# EAGLE design untitled (EAGLE 9.4.2)
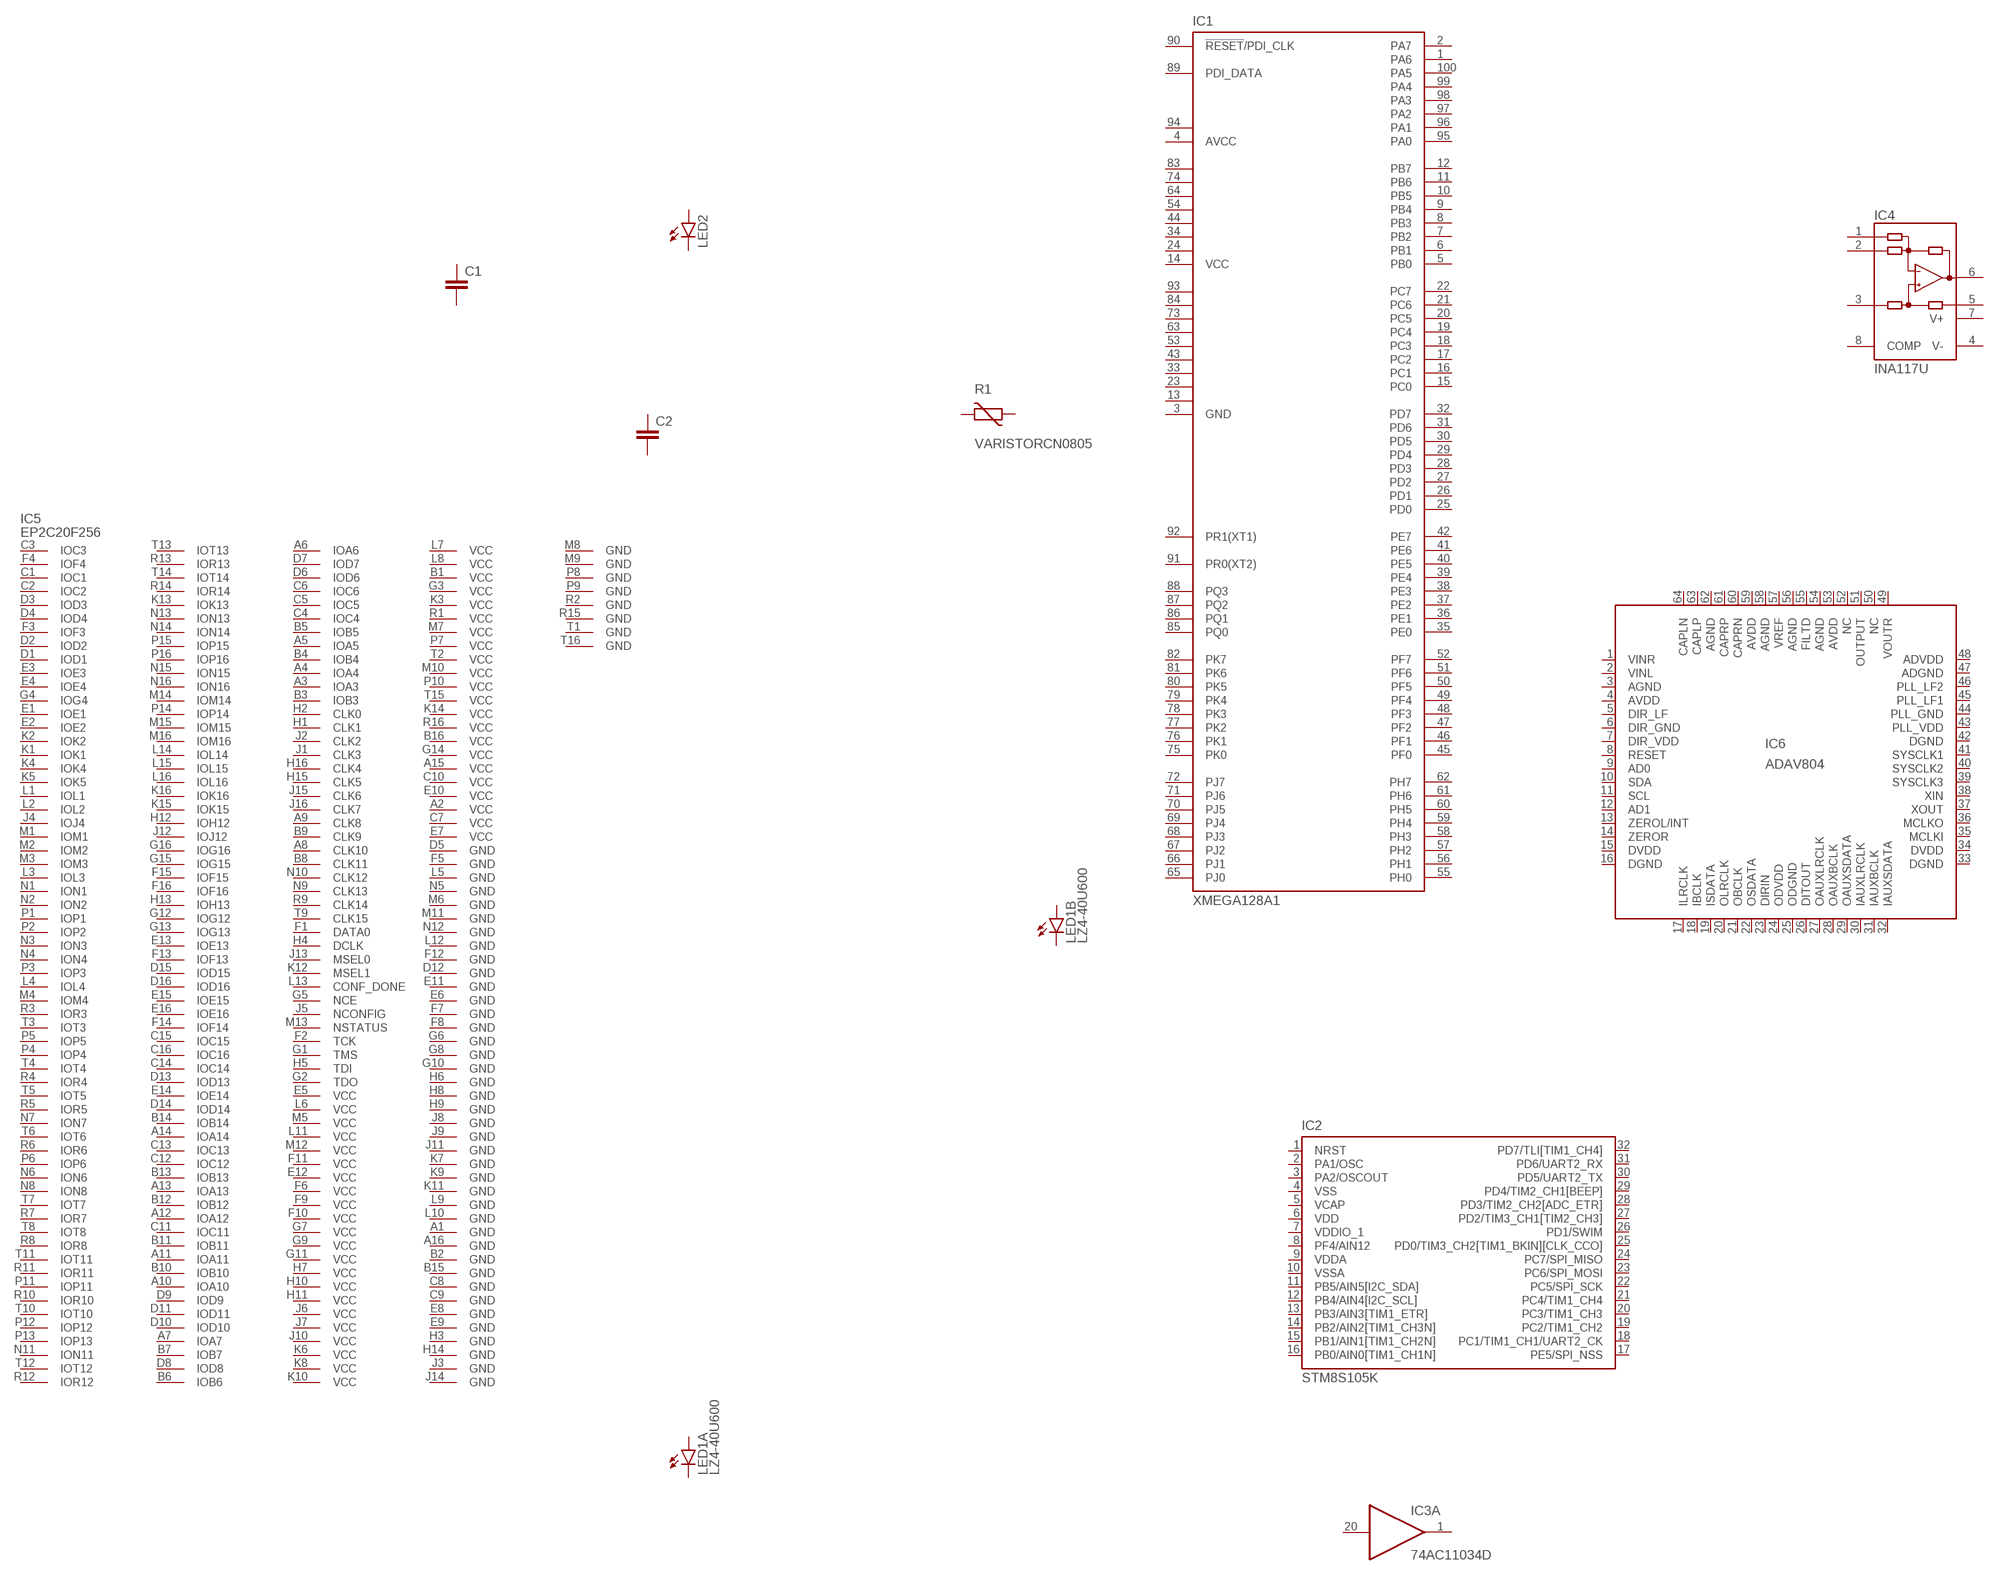
[diagram p0: schematic, sheet 1]

## Parts
C1  C-EUC1206  [C1206]
C2  C-EUC1206  [C1206]
IC1  XMEGA128A1  [TQFP100]
IC2  STM8S105K  [UFQFPN32]
IC3  74AC11034D  [SO20W]
IC4  INA117U  [SO08]
IC5  EP2C20F256  [FBGA256]
IC6  ADAV804  [LQFP-ST-64-2]
LED1  LZ4-40U600  [LZ4-40U600]
LED2  LEDSMT1206  [1206]
R1  VARISTORCN0805  [CT/CN0805]
Unconnected: C1.1 C1.2 C2.1 C2.2 IC1.1(PA6) IC1.2(PA7) IC1.5(PB0) IC1.6(PB1) IC1.7(PB2) IC1.8(PB3) IC1.9(PB4) IC1.10(PB5) IC1.11(PB6) IC1.12(PB7) IC1.15(PC0) IC1.16(PC1) IC1.17(PC2) IC1.18(PC3) IC1.19(PC4) IC1.20(PC5) IC1.21(PC6) IC1.22(PC7) IC1.25(PD0) IC1.26(PD1) IC1.27(PD2) IC1.28(PD3) IC1.29(PD4) IC1.30(PD5) IC1.31(PD6) IC1.32(PD7) IC1.35(PE0) IC1.36(PE1) IC1.37(PE2) IC1.38(PE3) IC1.39(PE4) IC1.40(PE5) IC1.41(PE6) IC1.42(PE7) IC1.45(PF0) IC1.46(PF1) IC1.47(PF2) IC1.48(PF3) IC1.49(PF4) IC1.50(PF5) IC1.51(PF6) IC1.52(PF7) IC1.55(PH0) IC1.56(PH1) IC1.57(PH2) IC1.58(PH3) IC1.59(PH4) IC1.60(PH5) IC1.61(PH6) IC1.62(PH7) IC1.65(PJ0) IC1.66(PJ1) IC1.67(PJ2) IC1.68(PJ3) IC1.69(PJ4) IC1.70(PJ5) IC1.71(PJ6) IC1.72(PJ7) IC1.75(PK0) IC1.76(PK1) IC1.77(PK2) IC1.78(PK3) IC1.79(PK4) IC1.80(PK5) IC1.81(PK6) IC1.82(PK7) IC1.85(PQ0) IC1.86(PQ1) IC1.87(PQ2) IC1.88(PQ3) IC1.89(PDI_DATA) IC1.90(!RESET!/PDI_CLK) IC1.91(PR0(XT2)) IC1.92(PR1(XT1)) IC1.95(PA0) IC1.96(PA1) IC1.97(PA2) IC1.98(PA3) IC1.99(PA4) IC1.100(PA5) IC2.1(NRST) IC2.2(PA1/OSC) IC2.3(PA2/OSCOUT) IC2.8(PF4/AIN12) IC2.11(PB5/AIN5[I2C_SDA]) IC2.12(PB4/AIN4[I2C_SCL]) IC2.13(PB3/AIN3[TIM1_ETR]) IC2.14(PB2/AIN2[TIM1_CH3N]) IC2.15(PB1/AIN1[TIM1_CH2N]) IC2.16(PB0/AIN0[TIM1_CH1N]) IC2.17(PE5/SPI_NSS) IC2.18(PC1/TIM1_CH1/UART2_CK) IC2.19(PC2/TIM1_CH2) IC2.20(PC3/TIM1_CH3) IC2.21(PC4/TIM1_CH4) IC2.22(PC5/SPI_SCK) IC2.23(PC6/SPI_MOSI) IC2.24(PC7/SPI_MISO) IC2.25(PD0/TIM3_CH2[TIM1_BKIN][CLK_CCO]) IC2.26(PD1/SWIM) IC2.27(PD2/TIM3_CH1[TIM2_CH3]) IC2.28(PD3/TIM2_CH2[ADC_ETR]) IC2.29(PD4/TIM2_CH1[BEEP]) IC2.30(PD5/UART2_TX) IC2.31(PD6/UART2_RX) IC2.32(PD7/TLI[TIM1_CH4]) IC3.1(A:O) IC3.2(B:O) IC3.3(C:O) IC3.8(D:O) IC3.9(E:O) IC3.10(F:O) IC3.11(F:I) IC3.12(E:I) IC3.13(D:I) IC3.18(C:I) IC3.19(B:I) IC3.20(A:I) IC4.1(REFB) IC4.2(-IN) IC4.3(+IN) IC4.5(REFA) IC4.6(OUT) IC4.8(COMP) IC5.A3(IOA3) IC5.A4(IOA4) IC5.A5(IOA5) IC5.A6(IOA6) IC5.A7(IOA7) IC5.A8(CLK10) IC5.A9(CLK8) IC5.A10(IOA10) IC5.A11(IOA11) IC5.A12(IOA12) IC5.A13(IOA13) IC5.A14(IOA14) IC5.B3(IOB3) IC5.B4(IOB4) IC5.B5(IOB5) IC5.B6(IOB6) IC5.B7(IOB7) IC5.B8(CLK11) IC5.B9(CLK9) IC5.B10(IOB10) IC5.B11(IOB11) IC5.B12(IOB12) IC5.B13(IOB13) IC5.B14(IOB14) IC5.C1(IOC1) IC5.C2(IOC2) IC5.C3(IOC3) IC5.C4(IOC4) IC5.C5(IOC5) IC5.C6(IOC6) IC5.C11(IOC11) IC5.C12(IOC12) IC5.C13(IOC13) IC5.C14(IOC14) IC5.C15(IOC15) IC5.C16(IOC16) IC5.D1(IOD1) IC5.D2(IOD2) IC5.D3(IOD3) IC5.D4(IOD4) IC5.D6(IOD6) IC5.D7(IOD7) IC5.D8(IOD8) IC5.D9(IOD9) IC5.D10(IOD10) IC5.D11(IOD11) IC5.D13(IOD13) IC5.D14(IOD14) IC5.D15(IOD15) IC5.D16(IOD16) IC5.E1(IOE1) IC5.E2(IOE2) IC5.E3(IOE3) IC5.E4(IOE4) IC5.E13(IOE13) IC5.E14(IOE14) IC5.E15(IOE15) IC5.E16(IOE16) IC5.F1(DATA0) IC5.F2(TCK) IC5.F3(IOF3) IC5.F4(IOF4) IC5.F13(IOF13) IC5.F14(IOF14) IC5.F15(IOF15) IC5.F16(IOF16) IC5.G1(TMS) IC5.G2(TDO) IC5.G4(IOG4) IC5.G5(NCE) IC5.G12(IOG12) IC5.G13(IOG13) IC5.G15(IOG15) IC5.G16(IOG16) IC5.H1(CLK1) IC5.H2(CLK0) IC5.H4(DCLK) IC5.H5(TDI) IC5.H12(IOH12) IC5.H13(IOH13) IC5.H15(CLK5) IC5.H16(CLK4) IC5.J1(CLK3) IC5.J2(CLK2) IC5.J4(IOJ4) IC5.J5(NCONFIG) IC5.J12(IOJ12) IC5.J13(MSEL0) IC5.J15(CLK6) IC5.J16(CLK7) IC5.K1(IOK1) IC5.K2(IOK2) IC5.K4(IOK4) IC5.K5(IOK5) IC5.K12(MSEL1) IC5.K13(IOK13) IC5.K15(IOK15) IC5.K16(IOK16) IC5.L1(IOL1) IC5.L2(IOL2) IC5.L3(IOL3) IC5.L4(IOL4) IC5.L13(CONF_DONE) IC5.L14(IOL14) IC5.L15(IOL15) IC5.L16(IOL16) IC5.M1(IOM1) IC5.M2(IOM2) IC5.M3(IOM3) IC5.M4(IOM4) IC5.M13(NSTATUS) IC5.M14(IOM14) IC5.M15(IOM15) IC5.M16(IOM16) IC5.N1(ION1) IC5.N2(ION2) IC5.N3(ION3) IC5.N4(ION4) IC5.N6(ION6) IC5.N7(ION7) IC5.N8(ION8) IC5.N9(CLK13) IC5.N10(CLK12) IC5.N11(ION11) IC5.N13(ION13) IC5.N14(ION14) IC5.N15(ION15) IC5.N16(ION16) IC5.P1(IOP1) IC5.P2(IOP2) IC5.P3(IOP3) IC5.P4(IOP4) IC5.P5(IOP5) IC5.P6(IOP6) IC5.P11(IOP11) IC5.P12(IOP12) IC5.P13(IOP13) IC5.P14(IOP14) IC5.P15(IOP15) IC5.P16(IOP16) IC5.R3(IOR3) IC5.R4(IOR4) IC5.R5(IOR5) IC5.R6(IOR6) IC5.R7(IOR7) IC5.R8(IOR8) IC5.R9(CLK14) IC5.R10(IOR10) IC5.R11(IOR11) IC5.R12(IOR12) IC5.R13(IOR13) IC5.R14(IOR14) IC5.T3(IOT3) IC5.T4(IOT4) IC5.T5(IOT5) IC5.T6(IOT6) IC5.T7(IOT7) IC5.T8(IOT8) IC5.T9(CLK15) IC5.T10(IOT10) IC5.T11(IOT11) IC5.T12(IOT12) IC5.T13(IOT13) IC5.T14(IOT14) IC6.1(VINR) IC6.2(VINL) IC6.5(DIR_LF) IC6.6(DIR_GND) IC6.7(DIR_VDD) IC6.8(RESET) IC6.9(AD0) IC6.10(SDA) IC6.11(SCL) IC6.12(AD1) IC6.13(ZEROL/INT) IC6.14(ZEROR) IC6.17(ILRCLK) IC6.18(IBCLK) IC6.19(ISDATA) IC6.20(OLRCLK) IC6.21(OBCLK) IC6.22(OSDATA) IC6.23(DIRIN) IC6.26(DITOUT) IC6.27(OAUXLRCLK) IC6.28(OAUXBCLK) IC6.29(OAUXSDATA) IC6.30(IAUXLRCLK) IC6.31(IAUXBCLK) IC6.32(IAUXSDATA) IC6.35(MCLKI) IC6.36(MCLKO) IC6.37(XOUT) IC6.38(XIN) IC6.39(SYSCLK3) IC6.40(SYSCLK2) IC6.41(SYSCLK1) IC6.42(DGND) IC6.43(PLL_VDD) IC6.44(PLL_GND) IC6.45(PLL_LF1) IC6.46(PLL_LF2) IC6.49(VOUTR) IC6.50(NC) IC6.51(OUTPUT) IC6.52(NC) IC6.55(FILTD) IC6.57(VREF) IC6.59(AVDD) IC6.60(CAPRN) IC6.61(CAPRP) IC6.63(CAPLP) IC6.64(CAPLN) LED1.1(A:A) LED1.2(A:C) LED1.3(B:A) LED1.4(B:C) LED1.5(C:A) LED1.6(C:C) LED1.7(D:A) LED1.8(D:C) LED2.A LED2.C R1.1 R1.2

## Power pins joined to a net without a drawn wire
ADGND: IC6.47(ADGND)
ADVDD: IC6.48(ADVDD)
AGND: IC6.3(AGND) IC6.54(AGND) IC6.56(AGND) IC6.58(AGND) IC6.62(AGND)
AVCC: IC1.4(AVCC)
AVCC1: IC1.94(AVCC1)
AVDD: IC6.4(AVDD) IC6.53(AVDD)
DGND: IC6.16(DGND) IC6.33(DGND)
DVDD: IC6.15(DVDD) IC6.34(DVDD)
GND: IC1.3(GND) IC3.4(P:GND) IC3.5(P:GND) IC3.6(P:GND) IC3.7(P:GND) IC5.A1(GND) IC5.A16(GND) IC5.B2(GND) IC5.B15(GND) IC5.C8(GND) IC5.C9(GND) IC5.D5(GND) IC5.D12(GND) IC5.E6(GND) IC5.E8(GND) IC5.E9(GND) IC5.E11(GND) IC5.F5(GND) IC5.F7(GND) IC5.F8(GND) IC5.F12(GND) IC5.G6(GND) IC5.G8(GND) IC5.G10(GND) IC5.H3(GND) IC5.H6(GND) IC5.H8(GND) IC5.H9(GND) IC5.H14(GND) IC5.J3(GND) IC5.J8(GND) IC5.J9(GND) IC5.J11(GND) IC5.J14(GND) IC5.K7(GND) IC5.K9(GND) IC5.K11(GND) IC5.L5(GND) IC5.L9(GND) IC5.L10(GND) IC5.L12(GND) IC5.M6(GND) IC5.M8(GND) IC5.M9(GND) IC5.M11(GND) IC5.N5(GND) IC5.N12(GND) IC5.P8(GND) IC5.P9(GND) IC5.R2(GND) IC5.R15(GND) IC5.T1(GND) IC5.T16(GND)
GND1: IC1.13(GND1)
GND2: IC1.23(GND2)
GND3: IC1.33(GND3)
GND4: IC1.43(GND4)
GND5: IC1.53(GND5)
GND6: IC1.63(GND6)
GND7: IC1.73(GND7)
GND8: IC1.84(GND8)
GND9: IC1.93(GND9)
ODGND: IC6.25(ODGND)
ODVDD: IC6.24(ODVDD)
V+: IC4.7(V+)
V-: IC4.4(V-)
VCAP: IC2.5(VCAP)
VCC: IC1.14(VCC) IC3.15(P:VCC) IC3.16(P:VCC) IC5.A2(VCC) IC5.A15(VCC) IC5.B1(VCC) IC5.B16(VCC) IC5.C7(VCC) IC5.C10(VCC) IC5.E5(VCC) IC5.E7(VCC) IC5.E10(VCC) IC5.E12(VCC) IC5.F6(VCC) IC5.F9(VCC) IC5.F10(VCC) IC5.F11(VCC) IC5.G3(VCC) IC5.G7(VCC) IC5.G9(VCC) IC5.G11(VCC) IC5.G14(VCC) IC5.H7(VCC) IC5.H10(VCC) IC5.H11(VCC) IC5.J6(VCC) IC5.J7(VCC) IC5.J10(VCC) IC5.K3(VCC) IC5.K6(VCC) IC5.K8(VCC) IC5.K10(VCC) IC5.K14(VCC) IC5.L6(VCC) IC5.L7(VCC) IC5.L8(VCC) IC5.L11(VCC) IC5.M5(VCC) IC5.M7(VCC) IC5.M10(VCC) IC5.M12(VCC) IC5.P7(VCC) IC5.P10(VCC) IC5.R1(VCC) IC5.R16(VCC) IC5.T2(VCC) IC5.T15(VCC)
VCC1: IC1.24(VCC1)
VCC2: IC1.34(VCC2)
VCC3: IC1.44(VCC3)
VCC4: IC1.54(VCC4)
VCC5: IC1.64(VCC5)
VCC6: IC1.74(VCC6)
VCC7: IC1.83(VCC7)
VDD: IC2.6(VDD)
VDDA: IC2.9(VDDA)
VDDIO_1: IC2.7(VDDIO_1)
VSS: IC2.4(VSS)
VSSA: IC2.10(VSSA)

## Library data of the parts
C1 C2 = rcl:C-EU: CAPACITOR, European symbol; SPICEPREFIX: C
IC1 = atmel:XMEGA128A1: MICROCONTROLLER Features High-performance, Low-power 8/16-bit AVR XMEGA Microcontroller Non-Volatile Program and Data Memories - 64K - 384K Bytes of In-System Self-Programmable Flash - 4K - 8K Bytes Boot Section with Independent Lock Bits - 2 KB - 4 KB EEPROM - 4 KB - 32 KB Internal SRAM External Bus Interface for up to 16M bytes SRAM External Bus Interface for up to 128M bit SDRAM Peripheral Features - Four-channel DMA Controller with support for external requests - Eight-channel Event System - Eight 16-bit Timer/Counters Four Timer/Counters with 4 Output Compare or Input Capture channels Four Timer/Counters with 2 Output Compare or Input Capture channels High-Resolution Extension on all Timer/Counters Advanced Waveform Extension on two Timer/Counters - Eight USARTs IrDA modulation/demodulation for one USART - Four Two-Wire Interfaces with dual address match (I2C and SMBus compatible) - Four SPI (Serial Peripheral Interface) peripherals - AES and DES Crypto Engine - 16-bit Real Time Counter with separate Oscillator - Two Eight-channel, 12-bit, 2 Msps Analog to Digital Converters - Two Two-channel, 12-bit, 1 Msps Digital to Analog Converters - Four Analog Comparators with Window compare function - External Interrupts on all General Purpose I/O pins - Programmable Watchdog Timer with Separate On-chip Ultra Low Power Oscillator Special Microcontroller Features - Power-on Reset and Programmable Brown-out Detection - Internal and External Clock Options with PLL and Prescaler - Programmable Multi-level Interrupt Controller - Sleep Modes: Idle, Power-down, Standby, Power-save, Extended Standby - Advanced Programming, Test and Debugging Interfaces JTAG (IEEE 1149.1 Compliant) Interface for programming, test and debugging PDI (Program and Debug Interface) for programming and debugging I/O and Packages - 78 Programmable I/O Lines - 100 - lead TQFP - 100 - ball CBGA - 100 - ball VFBGA Operating Voltage - 1.6 - 3.6V Speed performance - 0 - 12 MHz @ 1.6 - 3.6V - 0 - 32 MHz @ 2.7 - 3.6V Drawn by Dipl.-Ing. (FH) Robert Siegler Created: 27.05.09; OC_FARNELL: unknown; OC_NEWARK: unknown
IC2 = st-microelectronics:STM8S105K: Access line, 16 MHz STM8S 8-bit MCU up to 32 Kbytes Flash, integrated EEPROM,10-bit ADC, timers, UART, SPI, I²C Source: Data sheet <http://www.st.com/stonline/products/literature/ds/14771/stm8s105c4.pdf>; MPN: STM8S105K4U6; OC_FARNELL: 1706225; OC_NEWARK: 55R6975
IC3 = 74ac-logic:74AC11034: Hex non-inverting DRIVER
IC4 = burr-brown:INA117: Difference Amplifier High Common-Mode Voltage; MF: TEXAS INSTRUMENTS; MPN: INA117KU; OC_FARNELL: 1706653; OC_NEWARK: 17M6717
IC5 = altera-cyclone-II:EP2C20F256: EP2C20F256 Auto generated by make-symbol-device-package-bsdl.ulp Rev. 19 Tip: Use split-device-symbol.ulp to generate a Device with multiple small symbols! Read HELP. Source: EP2C20F256.BSD; MPN: EP2C20F256I8N; OC_FARNELL: 1453469; OC_NEWARK: 52R0507
IC6 = analog-devices:ADAV804: Audio Codec For Recordable DVD Auto generated by make-symbol-device-package-bsdl.ulp Rev. 33 Source: http://www.analog.com/static/imported-files/data_sheets/ADAV804.pdf; OC_FARNELL: unknown; OC_NEWARK: unknown
LED1 = led:LZ4-40U600: High Efficacy 365nm UV LED Emitter Source: Data sheet <http://www.ledengin.com/files/products/LZ4/LZ4-00U600.pdf>
LED2 = led:LED: LED OSRAM: - CHIPLED LG R971, LG N971, LY N971, LG Q971, LY Q971, LO R971, LY R971 LH N974, LH R974 LS Q976, LO Q976, LY Q976 LO Q996 - Hyper CHIPLED LW Q18S LB Q993, LB Q99A, LB R99A - SideLED LS A670, LO A670, LY A670, LG A670, LP A670 LB A673, LV A673, LT A673, LW A673 LH A674 LY A675 LS A676, LA A676, LO A676, LY A676, LW A676 LS A679, LY A679, LG A679 - Hyper Micro SIDELED® LS Y876, LA Y876, LO Y876, LY Y876 LT Y87S - SmartLED LW L88C, LW L88S LB L89C, LB L89S, LG L890 LS L89K, LO L89K, LY L89K LS L896, LA L896, LO L896, LY L896 - TOPLED LS T670, LO T670, LY T670, LG T670, LP T670 LSG T670, LSP T670, LSY T670, LOP T670, LYG T670 LG T671, LOG T671, LSG T671 LB T673, LV T673, LT T673, LW T673 LH T674 LS T676, LA T676, LO T676, LY T676, LB T676, LH T676, LSB T676, LW T676 LB T67C, LV T67C, LT T67C, LS T67K, LO T67K, LY T67K, LW E67C LS E67B, LA E67B, LO E67B, LY E67B, LB E67C, LV E67C, LT E67C LW T67C LS T679, LY T679, LG T679 LS T770, LO T770, LY T770, LG T770, LP T770 LB T773, LV T773, LT T773, LW T773 LH T774 LS E675, LA E675, LY E675, LS T675 LS T776, LA T776, LO T776, LY T776, LB T776 LHGB T686 LT T68C, LB T68C - Hyper Mini TOPLED® LB M676 - Mini TOPLED Santana® LG M470 LS M47K, LO M47K, LY M47K Source: http://www.osram.convergy.de LUXEON: - LUMILED® LXK2-PW12-R00, LXK2-PW12-S00, LXK2-PW14-U00, LXK2-PW14-V00 LXK2-PM12-R00, LXK2-PM12-S00, LXK2-PM14-U00 LXK2-PE12-Q00, LXK2-PE12-R00, LXK2-PE12-S00, LXK2-PE14-T00, LXK2-PE14-U00 LXK2-PB12-K00, LXK2-PB12-L00, LXK2-PB12-M00, LXK2-PB14-N00, LXK2-PB14-P00, LXK2-PB14-Q00 LXK2-PR12-L00, LXK2-PR12-M00, LXK2-PR14-Q00, LXK2-PR14-R00 LXK2-PD12-Q00, LXK2-PD12-R00, LXK2-PD12-S00 LXK2-PH12-R00, LXK2-PH12-S00 LXK2-PL12-P00, LXK2-PL12-Q00, LXK2-PL12-R00 Source: www.luxeon.com KINGBRIGHT: KA-3528ASYC Source: www.kingbright.com
R1 = varistor:VARISTOR: VARISTOR

## Board
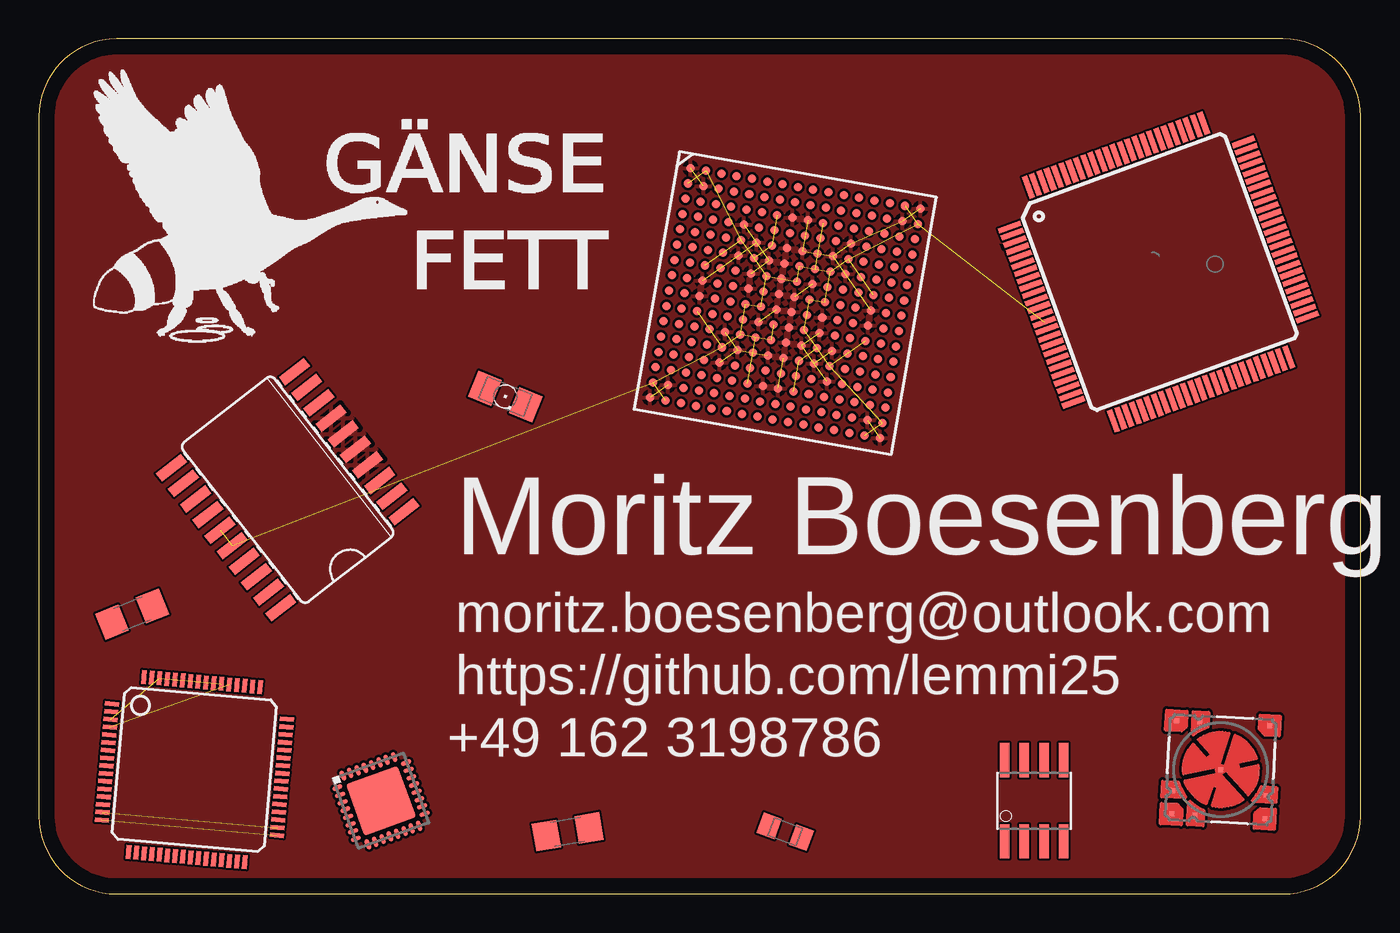
[diagram p1: board, top side]
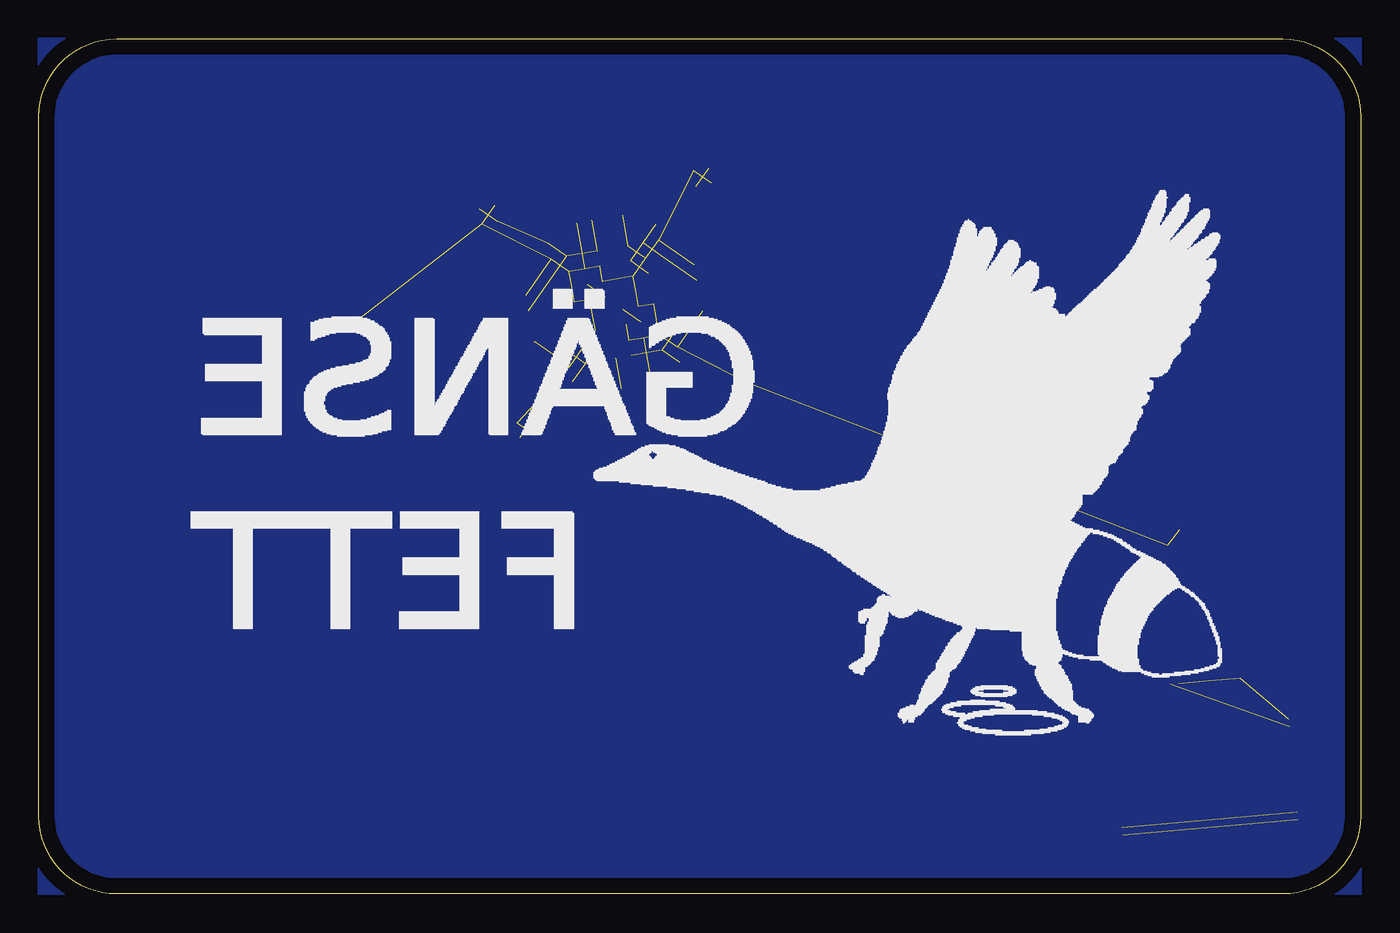
[diagram p2: board, bottom side, seen from below]

Size 85 x 55 mm. Coordinates in mm from the lower left corner, seen from the top.
Outline: 0,50 0,5 arc90 5,0 80,0 arc90 85,5 85,50 arc90 80,55 5,55 arc90 0,50
Copper layers (1*16): Top 0.035mm / dielectric 1.5mm / Bottom 0.035mm
Design rules "default": minimum track width 6mil, minimum drill 0.35mm, track to track 6mil, track to pad 6mil, pad to pad 6mil, via to via 6mil, smd to smd 6mil, copper to edge 40mil, drill to drill 6mil, minimum pad ring 10mil, minimum via ring 8mil, stop-mask expansion 4mil, vias tented up to drill 0mil, thermal gap 10mil
tKeepout: area 9.6,35.5 to 10.8,35.5; area 9.2,35.5 to 11.2,35.6; area 9,35.6 to 11.4,35.6; area 8.8,35.6 to 9.8,35.6; area 10.5,35.6 to 11.6,35.6; area 8.6,35.6 to 9.3,35.7; area 11.1,35.6 to 11.7,35.7; area 8.6,35.7 to 9.1,35.7; area 11.3,35.7 to 11.8,35.7; area 8.5,35.7 to 8.9,35.8; area 11.5,35.7 to 11.9,35.8; area 8.4,35.8 to 8.7,35.8; 2068 more areas
bKeepout: area 21.2,10.2 to 23.5,10.3; area 20.4,10.3 to 24.3,10.4; area 19.9,10.4 to 24.8,10.5; area 19.5,10.5 to 21.6,10.5; area 23.1,10.5 to 25.1,10.5; area 19.3,10.5 to 20.6,10.6; area 24.1,10.5 to 25.4,10.6; area 19.1,10.6 to 20.1,10.7; area 24.6,10.6 to 25.6,10.7; area 18.9,10.7 to 19.7,10.8; area 25,10.7 to 25.8,10.8; area 18.8,10.8 to 19.4,10.9; 2067 more areas

### Footprints (pad centres in the part's own frame; a part is rotated, then mirrored left to right if it is on the bottom)
C1206 = smd 1.6 x 1.8: 1 -1.4,0; 2 1.4,0
TQFP100 = smd 1.5 x 0.35: 1 -8,6; 2 -8,5.5; 3 -8,5; 4 -8,4.5; 5 -8,4; 6 -8,3.5; 7 -8,3; 8 -8,2.5; 9 -8,2; 10 -8,1.5; 11 -8,1; 12 -8,0.5; 13 -8,0; 14 -8,-0.5; 15 -8,-1; 16 -8,-1.5; 17 -8,-2; 18 -8,-2.5; 19 -8,-3; 20 -8,-3.5; 21 -8,-4; 22 -8,-4.5; 23 -8,-5; 24 -8,-5.5; 25 -8,-6; 51 8,-6; 52 8,-5.5; 53 8,-5; 54 8,-4.5; 55 8,-4; 56 8,-3.5; 57 8,-3; 58 8,-2.5; 59 8,-2; 60 8,-1.5; 61 8,-1; 62 8,-0.5; 63 8,0; 64 8,0.5; 65 8,1; 66 8,1.5; 67 8,2; 68 8,2.5; 69 8,3; 70 8,3.5; 71 8,4; 72 8,4.5; 73 8,5; 74 8,5.5; 75 8,6 | smd 0.35 x 1.5: 26 -6,-8; 27 -5.5,-8; 28 -5,-8; 29 -4.5,-8; 30 -4,-8; 31 -3.5,-8; 32 -3,-8; 33 -2.5,-8; 34 -2,-8; 35 -1.5,-8; 36 -1,-8; 37 -0.5,-8; 38 0,-8; 39 0.5,-8; 40 1,-8; 41 1.5,-8; 42 2,-8; 43 2.5,-8; 44 3,-8; 45 3.5,-8; 46 4,-8; 47 4.5,-8; 48 5,-8; 49 5.5,-8; 50 6,-8; 76 6,8; 77 5.5,8; 78 5,8; 79 4.5,8; 80 4,8; 81 3.5,8; 82 3,8; 83 2.5,8; 84 2,8; 85 1.5,8; 86 1,8; 87 0.5,8; 88 0,8; 89 -0.5,8; 90 -1,8; 91 -1.5,8; 92 -2,8; 93 -2.5,8; 94 -3,8; 95 -3.5,8; 96 -4,8; 97 -4.5,8; 98 -5,8; 99 -5.5,8; 100 -6,8
UFQFPN32 = smd 0.7 x 0.3: 1 -2.35,1.75; 2 -2.35,1.25; 3 -2.35,0.75; 4 -2.35,0.25; 5 -2.35,-0.25; 6 -2.35,-0.75; 7 -2.35,-1.25; 8 -2.35,-1.75; 17 2.35,-1.75; 18 2.35,-1.25; 19 2.35,-0.75; 20 2.35,-0.25; 21 2.35,0.25; 22 2.35,0.75; 23 2.35,1.25; 24 2.35,1.75 | smd 0.3 x 0.7: 9 -1.75,-2.35; 10 -1.25,-2.35; 11 -0.75,-2.35; 12 -0.25,-2.35; 13 0.25,-2.35; 14 0.75,-2.35; 15 1.25,-2.35; 16 1.75,-2.35; 25 1.75,2.35; 26 1.25,2.35; 27 0.75,2.35; 28 0.25,2.35; 29 -0.25,2.35; 30 -0.75,2.35; 31 -1.25,2.35; 32 -1.75,2.35 | smd 3.5 x 3.5: EXP 0,0
SO20W = smd 0.66 x 2.032: 1 -5.715,-5.029; 2 -4.445,-5.029; 3 -3.175,-5.029; 4 -1.905,-5.029; 5 -0.635,-5.029; 6 0.635,-5.029; 7 1.905,-5.029; 8 3.175,-5.029; 9 4.445,-5.029; 10 5.715,-5.029; 11 5.715,5.029; 12 4.445,5.029; 13 3.175,5.029; 14 1.905,5.029; 15 0.635,5.029; 16 -0.635,5.029; 17 -1.905,5.029; 18 -3.175,5.029; 19 -4.445,5.029; 20 -5.715,5.029
SO08 = smd 0.61 x 2.21: 1 -1.905,-2.616; 2 -0.635,-2.616; 3 0.635,-2.616; 4 1.905,-2.616; 5 1.905,2.616; 6 0.635,2.616; 7 -0.635,2.616; 8 -1.905,2.616
FBGA256 = smd 0.55 x 0.55: A1 -7.5,7.5; A2 -6.5,7.5; A3 -5.5,7.5; A4 -4.5,7.5; A5 -3.5,7.5; A6 -2.5,7.5; A7 -1.5,7.5; A8 -0.5,7.5; A9 0.5,7.5; A10 1.5,7.5; A11 2.5,7.5; A12 3.5,7.5; A13 4.5,7.5; A14 5.5,7.5; A15 6.5,7.5; A16 7.5,7.5; B1 -7.5,6.5; B2 -6.5,6.5; B3 -5.5,6.5; B4 -4.5,6.5; B5 -3.5,6.5; B6 -2.5,6.5; B7 -1.5,6.5; B8 -0.5,6.5; B9 0.5,6.5; B10 1.5,6.5; B11 2.5,6.5; B12 3.5,6.5; B13 4.5,6.5; B14 5.5,6.5; B15 6.5,6.5; B16 7.5,6.5; C1 -7.5,5.5; C2 -6.5,5.5; C3 -5.5,5.5; C4 -4.5,5.5; C5 -3.5,5.5; C6 -2.5,5.5; C7 -1.5,5.5; C8 -0.5,5.5; C9 0.5,5.5; C10 1.5,5.5; C11 2.5,5.5; C12 3.5,5.5; C13 4.5,5.5; C14 5.5,5.5; C15 6.5,5.5; C16 7.5,5.5; D1 -7.5,4.5; D2 -6.5,4.5; D3 -5.5,4.5; D4 -4.5,4.5; D5 -3.5,4.5; D6 -2.5,4.5; D7 -1.5,4.5; D8 -0.5,4.5; D9 0.5,4.5; D10 1.5,4.5; D11 2.5,4.5; D12 3.5,4.5; D13 4.5,4.5; D14 5.5,4.5; D15 6.5,4.5; D16 7.5,4.5; E1 -7.5,3.5; E2 -6.5,3.5; E3 -5.5,3.5; E4 -4.5,3.5; E5 -3.5,3.5; E6 -2.5,3.5; E7 -1.5,3.5; E8 -0.5,3.5; E9 0.5,3.5; E10 1.5,3.5; E11 2.5,3.5; E12 3.5,3.5; E13 4.5,3.5; E14 5.5,3.5; E15 6.5,3.5; E16 7.5,3.5; F1 -7.5,2.5; F2 -6.5,2.5; F3 -5.5,2.5; F4 -4.5,2.5; F5 -3.5,2.5; F6 -2.5,2.5; F7 -1.5,2.5; F8 -0.5,2.5; F9 0.5,2.5; F10 1.5,2.5; F11 2.5,2.5; F12 3.5,2.5; F13 4.5,2.5; F14 5.5,2.5; F15 6.5,2.5; F16 7.5,2.5; G1 -7.5,1.5; G2 -6.5,1.5; G3 -5.5,1.5; G4 -4.5,1.5; G5 -3.5,1.5; G6 -2.5,1.5; G7 -1.5,1.5; G8 -0.5,1.5; G9 0.5,1.5; G10 1.5,1.5; G11 2.5,1.5; G12 3.5,1.5; G13 4.5,1.5; G14 5.5,1.5; G15 6.5,1.5; G16 7.5,1.5; H1 -7.5,0.5; H2 -6.5,0.5; H3 -5.5,0.5; H4 -4.5,0.5; H5 -3.5,0.5; H6 -2.5,0.5; H7 -1.5,0.5; H8 -0.5,0.5; H9 0.5,0.5; H10 1.5,0.5; H11 2.5,0.5; H12 3.5,0.5; H13 4.5,0.5; H14 5.5,0.5; H15 6.5,0.5; H16 7.5,0.5; J1 -7.5,-0.5; J2 -6.5,-0.5; J3 -5.5,-0.5; J4 -4.5,-0.5; J5 -3.5,-0.5; J6 -2.5,-0.5; J7 -1.5,-0.5; J8 -0.5,-0.5; J9 0.5,-0.5; J10 1.5,-0.5; J11 2.5,-0.5; J12 3.5,-0.5; J13 4.5,-0.5; J14 5.5,-0.5; J15 6.5,-0.5; J16 7.5,-0.5; K1 -7.5,-1.5; K2 -6.5,-1.5; K3 -5.5,-1.5; K4 -4.5,-1.5; K5 -3.5,-1.5; K6 -2.5,-1.5; K7 -1.5,-1.5; K8 -0.5,-1.5; K9 0.5,-1.5; K10 1.5,-1.5; K11 2.5,-1.5; K12 3.5,-1.5; K13 4.5,-1.5; K14 5.5,-1.5; K15 6.5,-1.5; K16 7.5,-1.5; L1 -7.5,-2.5; L2 -6.5,-2.5; L3 -5.5,-2.5; L4 -4.5,-2.5; L5 -3.5,-2.5; L6 -2.5,-2.5; L7 -1.5,-2.5; L8 -0.5,-2.5; L9 0.5,-2.5; L10 1.5,-2.5; L11 2.5,-2.5; L12 3.5,-2.5; L13 4.5,-2.5; L14 5.5,-2.5; L15 6.5,-2.5; L16 7.5,-2.5; M1 -7.5,-3.5; M2 -6.5,-3.5; M3 -5.5,-3.5; M4 -4.5,-3.5; M5 -3.5,-3.5; M6 -2.5,-3.5; M7 -1.5,-3.5; M8 -0.5,-3.5; M9 0.5,-3.5; M10 1.5,-3.5; M11 2.5,-3.5; M12 3.5,-3.5; M13 4.5,-3.5; M14 5.5,-3.5; M15 6.5,-3.5; M16 7.5,-3.5; N1 -7.5,-4.5; N2 -6.5,-4.5; N3 -5.5,-4.5; N4 -4.5,-4.5; N5 -3.5,-4.5; N6 -2.5,-4.5; N7 -1.5,-4.5; N8 -0.5,-4.5; N9 0.5,-4.5; N10 1.5,-4.5; N11 2.5,-4.5; N12 3.5,-4.5; N13 4.5,-4.5; N14 5.5,-4.5; N15 6.5,-4.5; N16 7.5,-4.5; P1 -7.5,-5.5; P2 -6.5,-5.5; P3 -5.5,-5.5; P4 -4.5,-5.5; P5 -3.5,-5.5; P6 -2.5,-5.5; P7 -1.5,-5.5; P8 -0.5,-5.5; P9 0.5,-5.5; P10 1.5,-5.5; P11 2.5,-5.5; P12 3.5,-5.5; P13 4.5,-5.5; P14 5.5,-5.5; P15 6.5,-5.5; P16 7.5,-5.5; R1 -7.5,-6.5; R2 -6.5,-6.5; R3 -5.5,-6.5; R4 -4.5,-6.5; R5 -3.5,-6.5; R6 -2.5,-6.5; R7 -1.5,-6.5; R8 -0.5,-6.5; R9 0.5,-6.5; R10 1.5,-6.5; R11 2.5,-6.5; R12 3.5,-6.5; R13 4.5,-6.5; R14 5.5,-6.5; R15 6.5,-6.5; R16 7.5,-6.5; T1 -7.5,-7.5; T2 -6.5,-7.5; T3 -5.5,-7.5; T4 -4.5,-7.5; T5 -3.5,-7.5; T6 -2.5,-7.5; T7 -1.5,-7.5; T8 -0.5,-7.5; T9 0.5,-7.5; T10 1.5,-7.5; T11 2.5,-7.5; T12 3.5,-7.5; T13 4.5,-7.5; T14 5.5,-7.5; T15 6.5,-7.5; T16 7.5,-7.5
LQFP-ST-64-2 = smd 0.9 x 0.3: 1 -5.65,3.75; 2 -5.65,3.25; 3 -5.65,2.75; 4 -5.65,2.25; 5 -5.65,1.75; 6 -5.65,1.25; 7 -5.65,0.75; 8 -5.65,0.25; 9 -5.65,-0.25; 10 -5.65,-0.75; 11 -5.65,-1.25; 12 -5.65,-1.75; 13 -5.65,-2.25; 14 -5.65,-2.75; 15 -5.65,-3.25; 16 -5.65,-3.75; 33 5.65,-3.75; 34 5.65,-3.25; 35 5.65,-2.75; 36 5.65,-2.25; 37 5.65,-1.75; 38 5.65,-1.25; 39 5.65,-0.75; 40 5.65,-0.25; 41 5.65,0.25; 42 5.65,0.75; 43 5.65,1.25; 44 5.65,1.75; 45 5.65,2.25; 46 5.65,2.75; 47 5.65,3.25; 48 5.65,3.75 | smd 0.3 x 0.9: 17 -3.75,-5.65; 18 -3.25,-5.65; 19 -2.75,-5.65; 20 -2.25,-5.65; 21 -1.75,-5.65; 22 -1.25,-5.65; 23 -0.75,-5.65; 24 -0.25,-5.65; 25 0.25,-5.65; 26 0.75,-5.65; 27 1.25,-5.65; 28 1.75,-5.65; 29 2.25,-5.65; 30 2.75,-5.65; 31 3.25,-5.65; 32 3.75,-5.65; 49 3.75,5.65; 50 3.25,5.65; 51 2.75,5.65; 52 2.25,5.65; 53 1.75,5.65; 54 1.25,5.65; 55 0.75,5.65; 56 0.25,5.65; 57 -0.25,5.65; 58 -0.75,5.65; 59 -1.25,5.65; 60 -1.75,5.65; 61 -2.25,5.65; 62 -2.75,5.65; 63 -3.25,5.65; 64 -3.75,5.65
LZ4-40U600 = smd 0.3 x 0.3: 1 -3,3; 2 -1.5,3; 3 3,3; 4 3,-1.5; 5 3,-3; 6 -1.5,-3; 7 -3,-3; 8 -3,-1.5; TH 0,0
1206 = smd 1.6 x 1.803: A -1.422,0; C 1.422,0
CT/CN0805 = smd 1.2 x 1.4: 1 -1.1,0; 2 1.1,0

### Placement (x,y rotation side)
C1  34,4 10 top
C2  6,18 22 top
IC1  72,40 20 top
IC2  22,6 20 top
IC3  16,26 128 top
IC4  64,6 0 top
IC5  48,38 350 top
IC6  10,8 355 top
LED1  76,8 357 top
LED2  30,32 338 top
R1  48,4 340 top

### Tracks (layer width: path | path; a pad name or v marks a point on that pad's centre or on a via)
AGND  (4 unrouted)
AVDD  (1 unrouted)
DGND  (1 unrouted)
DVDD  (1 unrouted)
GND  (25 unrouted)
  pour Top: 5,55 80,55 arc-90 85,50 85,5 arc-90 80,0 5,0 arc-90 0,5 0,50 arc-90
  pour Top: 0,55 85,55 85,0 0,0
  pour Bottom: 0,55 85,55 85,0 0,0
VCC  (46 unrouted)

### Text on the board
tPlace: Moritz Boesenberg | moritz.boesenberg@outlook.com | https://github.com/lemmi25 | +49 162 3198786
tStop: Moritz Boesenberg | moritz.boesenberg@outlook.com | https://github.com/lemmi25 | +49 162 3198786
tKeepout: Moritz Boesenberg | moritz.boesenberg@outlook.com | https://github.com/lemmi25 | +49 162 3198786